# EAGLE schematic midi_out (EAGLE 6.2)
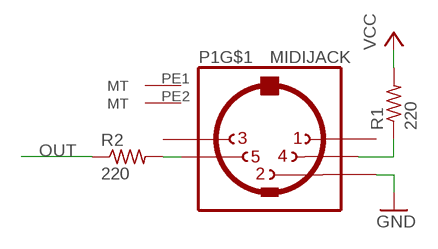
[diagram p0: schematic, sheet 1]

## Parts
P1  MIDIJACK  [CP-2350]
R1  220  R-US_0204/5  [0204/5]
R2  220  R-US_0204/5  [0204/5]

## Nets
GND: P1.2
N$1: P1.4 R1.1
N$2: P1.5 R2.2
OUT: R2.1
VCC: R1.2
Unconnected: P1.1 P1.3 P1.PE1(MT) P1.PE2(MT) P1.PE(MT) P1.PE@(MT)

## Library data of the parts
P1 = adafruit:MIDIJACK: DIN 5 jack also known as MIDI jack A modification of conn-hirshman:MAB5SH with two options for the grounding 'teeth'
R1 R2 = rcl:R-US_: RESISTOR, American symbol